# Altium schematic sheet 03_LCD-Other.SchDoc
size A4; Organization: Altium Limited; Address1: L3, 12a Rodborough Rd; Address2: Frenchs Forest; Address3: NSW; Address4: Australia 2086
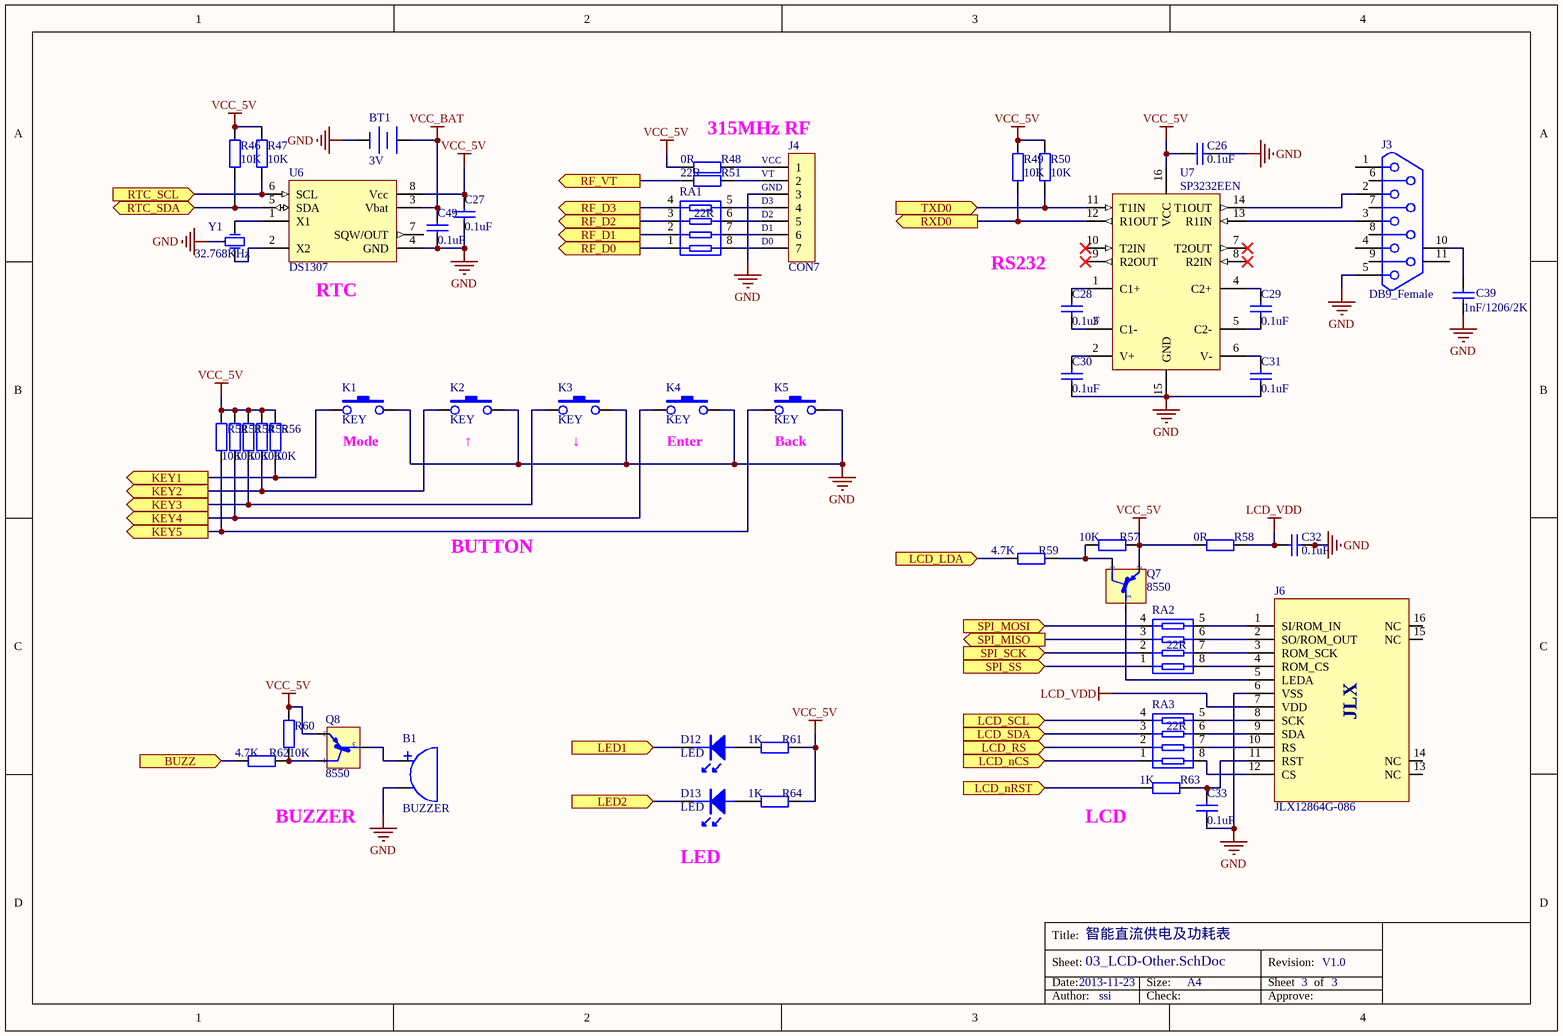
[diagram p0: 03_LCD-Other.SchDoc]

## Parts
B1  BUZZER  [BUZZ]
BT1  3V  [BATTERY_Mi]
C26  0.1uF  [0603C]
C27  0.1uF  [0603C]
C28  0.1uF  [0603C]
C29  0.1uF  [0603C]
C30  0.1uF  [0603C]
C31  0.1uF  [0603C]
C32  0.1uF  [0603C]
C33  0.1uF  [0603C]
C39  1nF/1206/2K  [1206]
C49  0.1uF  [0603C]
D12  LED  [LED-3.5mm]
D13  LED  [LED-3.5mm]
J3  DB9_Female  [DB9_F]
J4  CON7  [SIP7]
J6  JLX12864G-086  [JLX12864G-086]
K1  KEY  [SW_AJ_6X6]
K2  KEY  [SW_AJ_6X6]
K3  KEY  [SW_AJ_6X6]
K4  KEY  [SW_AJ_6X6]
K5  KEY  [SW_AJ_6X6]
Q7  8550  [SOT-23]
Q8  8550  [SOT-23]
R46  10K  [0603]
R47  10K  [0603]
R48  0R  [0603]
R49  10K  [0603]
R50  10K  [0603]
R51  22R  [0603]
R52  10K  [0603]
R53  10K  [0603]
R54  10K  [0603]
R55  10K  [0603]
R56  10K  [0603]
R57  10K  [0603]
R58  0R  [0603]
R59  4.7K  [0603]
R60  10K  [0603]
R61  1K  [0603]
R62  4.7K  [0603]
R63  1K  [0603]
R64  1K  [0603]
RA1  22R  [0603x4]
RA2  22R  [0603x4]
RA3  22R  [0603x4]
U6  DS1307  [SO-8]
U7  SP3232EEN  [SO16]
Y1  32.768KHz  [XTAL-32K-B]

## Ports
BUZZ (in), KEY1 (out), KEY2 (out), KEY3 (out), KEY4 (out), KEY5 (out), LCD_LDA (in), LCD_nCS (in), LCD_nRST (in), LCD_RS (in), LCD_SCL (in), LCD_SDA (in), LED1 (in), LED2 (in), RF_D0 (out), RF_D1 (out), RF_D2 (out), RF_D3 (out), RF_VT (out), RTC_SCL (in), RTC_SDA (bidir), RXD0 (out), SPI_MISO (out), SPI_MOSI (in), SPI_SCK (in), SPI_SS (in), TXD0 (in)

## Nets
GND: B1.2(B) BT1.2(-) C26.1 C27.1 C30.1 C31.1 C32.1 C33.1 C39.1 C49.2 J3.5 J4.3 J6.6(VSS) K1.2 K2.2 K3.2 K4.2 K5.2 U6.4(GND) U7.15(GND) Y1.3
LCD_VDD: C32.2 J6.7(VDD) R58.1
VCC_5V: C26.2 C27.2 Q7.2(E) Q8.2(E) R46.1 R47.1 R48.2 R49.1 R50.1 R52.2 R53.2 R54.2 R55.2 R56.2 R57.1 R58.2 R60.2 R61.2 R64.2 U6.8(Vcc) U7.16(VCC)
VCC_BAT: BT1.1(+) C49.1 U6.3(Vbat)
BUZZ: R62.1 ; port BUZZ
KEY1: K1.1 R56.1 ; port KEY1
KEY2: K2.1 R55.1 ; port KEY2
KEY3: K3.1 R54.1 ; port KEY3
KEY4: K4.1 R53.1 ; port KEY4
KEY5: K5.1 R52.1 ; port KEY5
LCD_LDA: R59.2 ; port LCD_LDA
LCD_nCS: RA3.1 ; port LCD_nCS
LCD_nRST: R63.2 ; port LCD_nRST
LCD_RS: RA3.2 ; port LCD_RS
LCD_SCL: RA3.4 ; port LCD_SCL
LCD_SDA: RA3.3 ; port LCD_SDA
LED1: D12.2(K) ; port LED1
LED2: D13.2(K) ; port LED2
RF_D0: RA1.1 ; port RF_D0
RF_D1: RA1.2 ; port RF_D1
RF_D2: RA1.3 ; port RF_D2
RF_D3: RA1.4 ; port RF_D3
RF_VT: R51.2 ; port RF_VT
RTC_SCL: R47.2 U6.6(SCL) ; port RTC_SCL
RTC_SDA: R46.2 U6.5(SDA) ; port RTC_SDA
RXD0: R49.2 U7.12(R1OUT) ; port RXD0
SPI_MISO: RA2.3 ; port SPI_MISO
SPI_MOSI: RA2.4 ; port SPI_MOSI
SPI_SCK: RA2.2 ; port SPI_SCK
SPI_SS: RA2.1 ; port SPI_SS
TXD0: R50.2 U7.11(T1IN) ; port TXD0
NetB1_1: B1.1(A) Q8.3(C)
NetC28_1: C28.1 U7.3(C1-)
NetC28_2: C28.2 U7.1(C1+)
NetC29_1: C29.1 U7.5(C2-)
NetC29_2: C29.2 U7.4(C2+)
NetC30_2: C30.2 U7.2(V+)
NetC31_2: C31.2 U7.6(V-)
NetC33_2: C33.2 J6.11(RST) R63.1
NetC39_2: C39.2 J3.10
NetD12_1: D12.1(A) R61.1
NetD13_1: D13.1(A) R64.1
NetJ3_2: J3.2 U7.14(T1OUT)
NetJ3_3: J3.3 U7.13(R1IN)
NetJ4_1: J4.1 R48.1
NetJ4_2: J4.2 R51.1
NetJ4_4: J4.4 RA1.5
NetJ4_5: J4.5 RA1.6
NetJ4_6: J4.6 RA1.7
NetJ4_7: J4.7 RA1.8
NetJ6_1: J6.1(SI/ROM_IN) RA2.5
NetJ6_2: J6.2(SO/ROM_OUT) RA2.6
NetJ6_3: J6.3(ROM_SCK) RA2.7
NetJ6_4: J6.4(ROM_CS) RA2.8
NetJ6_5: J6.5(LEDA) Q7.3(C)
NetJ6_8: J6.8(SCK) RA3.5
NetJ6_9: J6.9(SDA) RA3.6
NetJ6_10: J6.10(RS) RA3.7
NetJ6_12: J6.12(CS) RA3.8
NetQ7_1: Q7.1(B) R57.2 R59.1
NetQ8_1: Q8.1(B) R60.1 R62.2
NetU6_1: U6.1(X1) Y1.2(OSC2)
NetU6_2: U6.2(X2) Y1.1(OSC1)

Not connected (* = marked no-connect by the designer): J3 1 4 6 7 8 9 11; J6 13(NC) 14(NC) 15(NC) 16(NC); U6 7(SQW/OUT); U7 7(T2OUT)* 8(R2IN)* 9(R2OUT)* 10(T2IN)*

## Notes on the sheet
- 315MHz RF
- (near J4) VCC
- (near J4) VT
- (near J4) GND
- (near J4) D3
- (near J4) D2
- (near J4) D1
- (near J4) D0
- (near U6) RTC
- (near C28) RS232
- (near K1) Mode
- (near K2) ↑
- (near K3) ↓
- (near K4) Enter
- (near K5) Back
- BUTTON
- BUZZER
- LCD
- LED
- 2013-11-23
- 智能直流供电及功耗表
- 3        3
- V1.0
- ssi
- Title:
- Sheet:
- Date:
- Size:
- A4
- Revision:
- Sheet
- of
- Author:
- Check:
- Approve:
- (in symbol JLX12864G-086) JLX

## Library data of the parts
BT1 = Battery: Multicell Battery; Published: 24-Mar-1999; LatestRevisionDate: 17-Jul-2002; LatestRevisionNote: Re-released for DXP Platform.; PackageReference: BAT-2; Publisher: Altium Limited
C26-C33 C39 C49 = Cap: Capacitor; Published: 8-Jun-2000; LatestRevisionDate: 17-Jul-2002; LatestRevisionNote: Re-released for DXP Platform.; PackageReference: RAD-0.3; Publisher: Altium Limited
J3 = DB9_F: DB9_Female 母
J6 = JLX12864G-086: LCD12864 mini,43.5x40.8mm
K1-K5 = KEY1
Q7 Q8 = PNP_T: PNP
R46-R64 = Res2: Resistor; Published: 8-Jun-2000; LatestRevisionDate: 17-Jul-2002; LatestRevisionNote: Re-released for DXP Platform.; PackageReference: AXIAL-0.4; Publisher: Altium Limited
RA1-RA3 = Res x4: Isolated Resistor Network
U7 = SP3232: 3  to 5V Powered, Multi-Channel RS-232 Driver/Receiver; Published: 16-Jan-2001; LatestRevisionDate: 06-Jun-2005; LatestRevisionNote: Stylized 3D Model Added.; PackageVersion: 1997; PackageReference: PE16A; Publisher: Altium Limited; PackageDescription: DIP; 16 Leads; Row Spacing 7.62 mm; Pitch 2.54 mm; Code_JEDEC: MS-001-BB; ComponentLink1Description: Manufacturer Link; ComponentLink1URL: http://www.maxim-ic.com/; ComponentLink2Description: Datasheet; ComponentLink2URL: http://pdfserv.maxim-ic.com/en/ds/MAX220-MAX249.pdf
Y1 = XTAL32-3: Crystal Oscillator; Published: 8-Jun-2000; LatestRevisionDate: 17-Jul-2002; LatestRevisionNote: Re-released for DXP Platform.; PackageReference: R38; Publisher: Altium Limited